# Altium project 国赛驱动板.PrjPcb
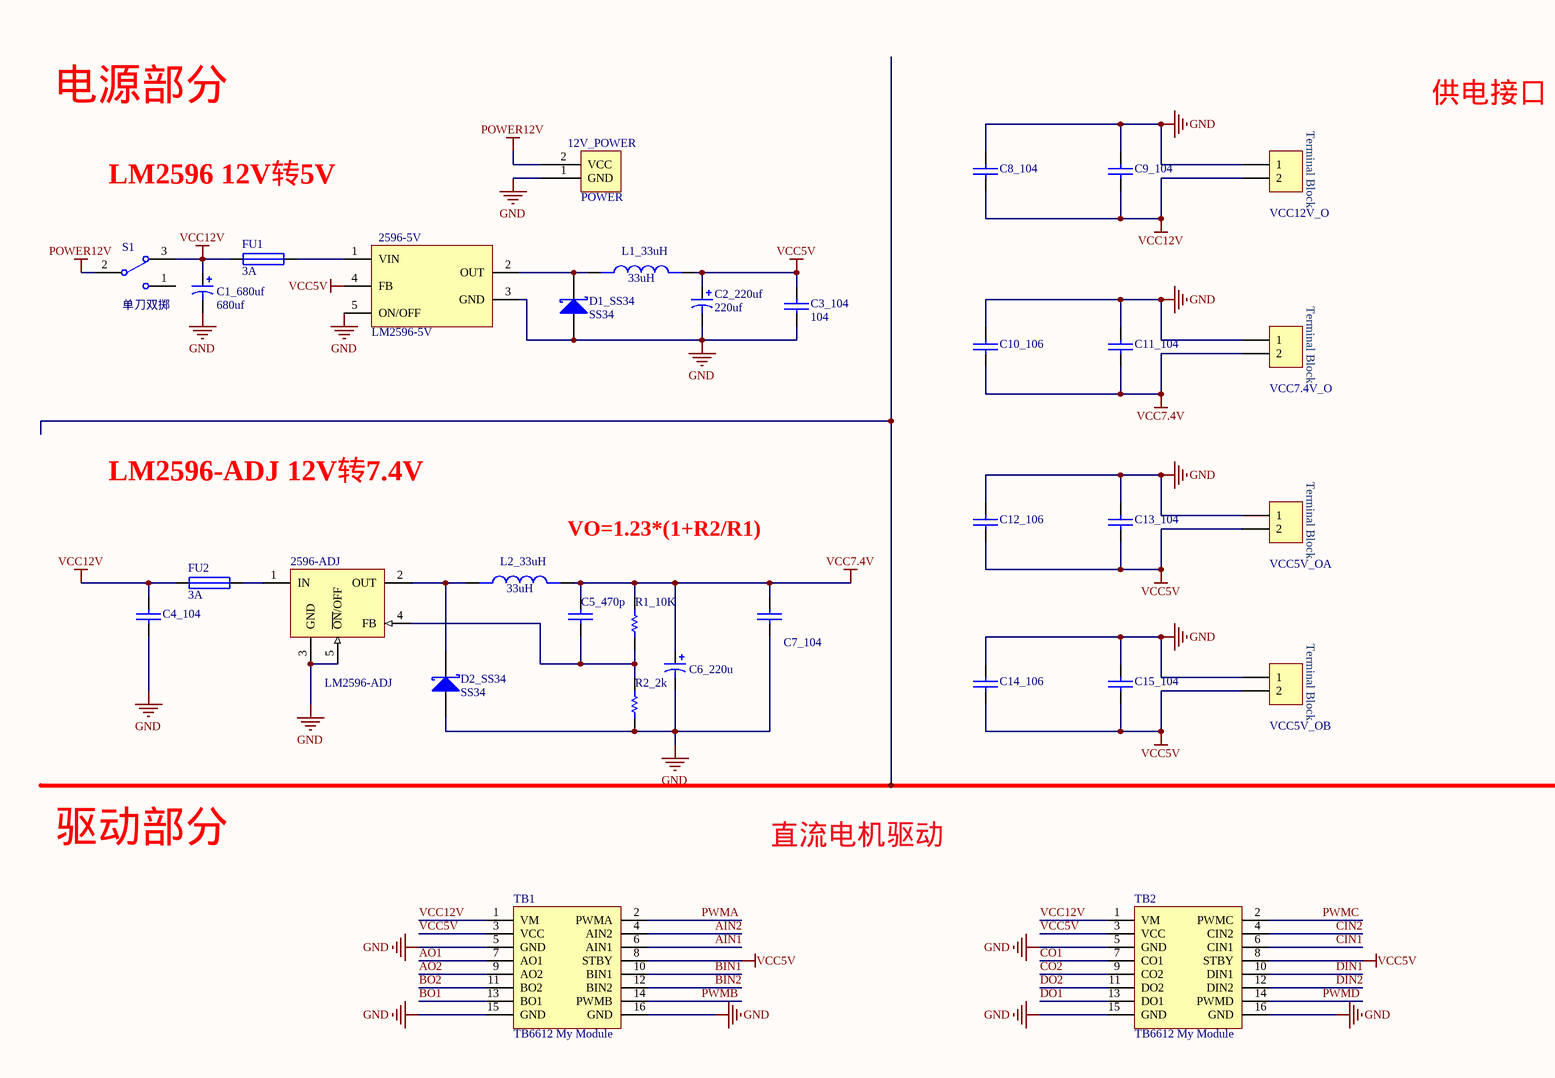
[diagram p0: 国赛驱动板原理图.SchDoc, top left]
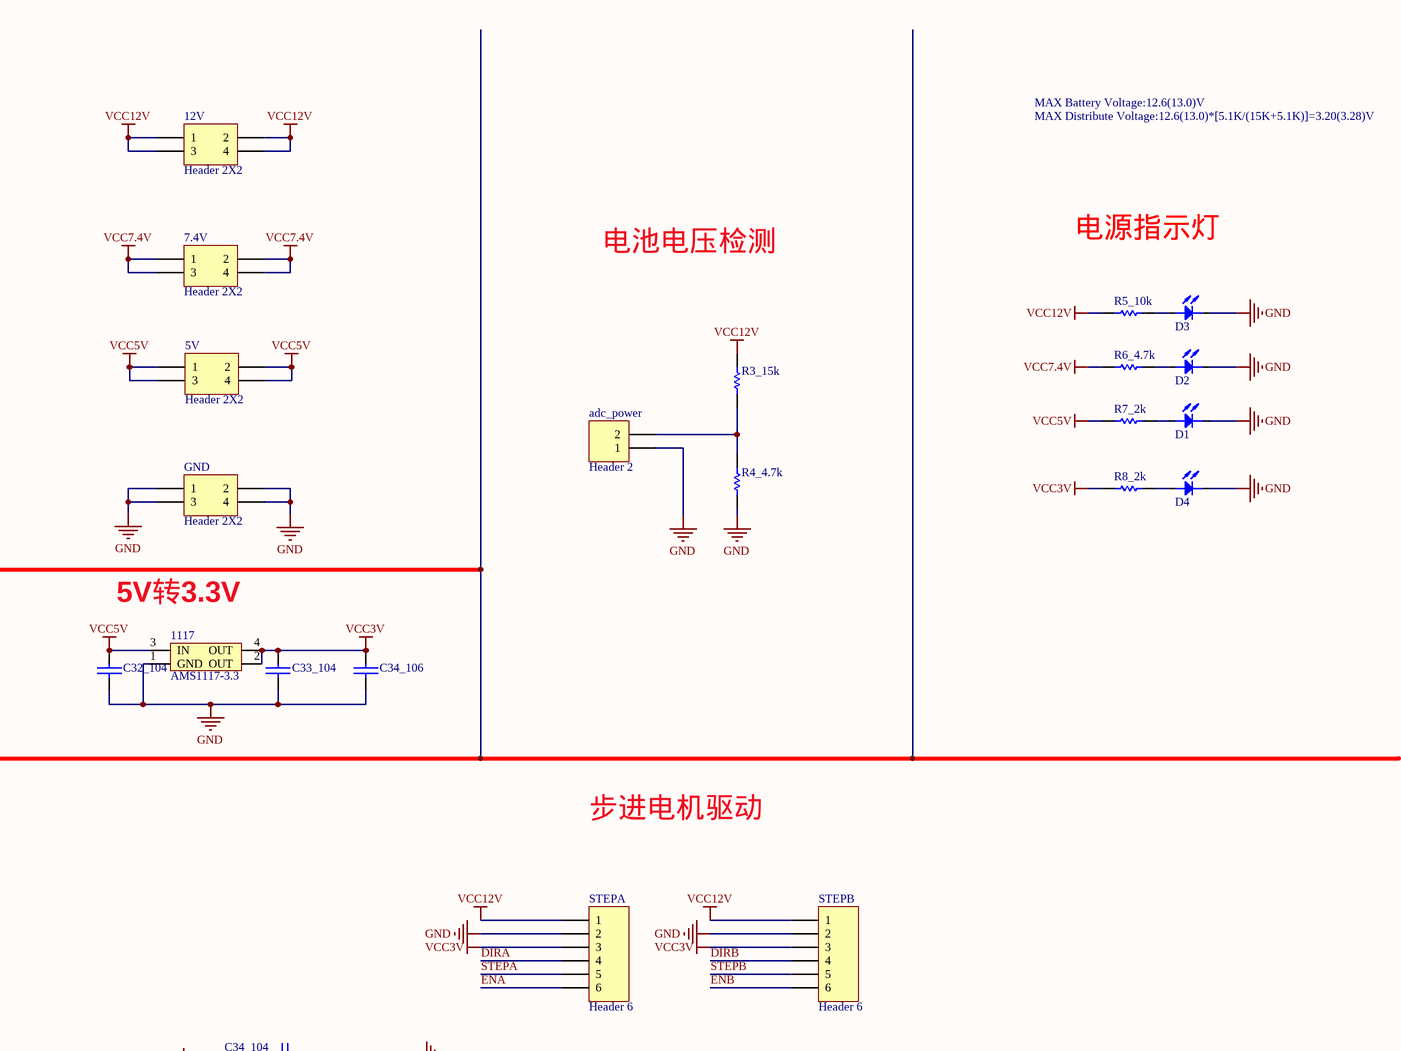
[diagram p1: 国赛驱动板原理图.SchDoc, top right]
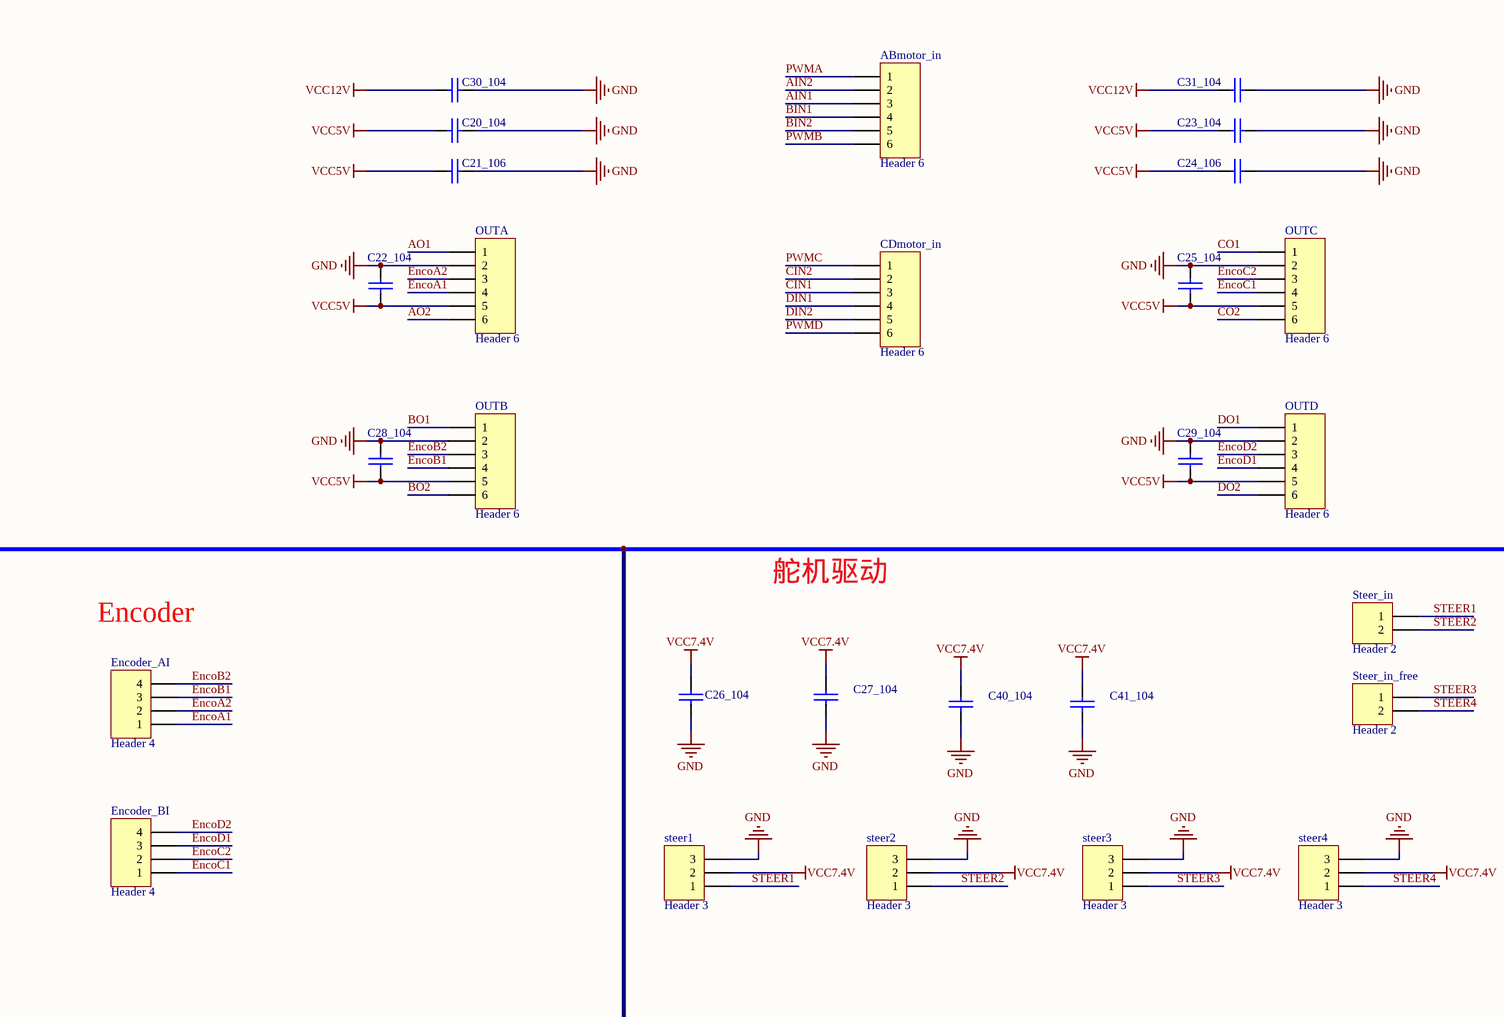
[diagram p2: 国赛驱动板原理图.SchDoc, bottom left]
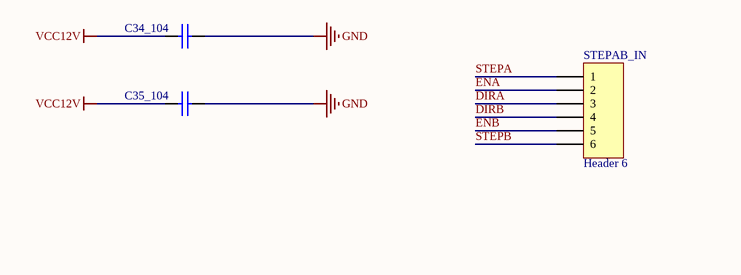
[diagram p3: 国赛驱动板原理图.SchDoc, bottom right]
1 sheet, 85 parts. Net scope: global (net labels, ports and power ports of the same name join across sheets).

## Sheet 国赛驱动板原理图.SchDoc
size A2

### Parts
5V  Header 2X2  [HDR2X2]
7.4V  Header 2X2  [HDR2X2]
12V  Header 2X2  [HDR2X2]
12V_POWER  POWER  [DG1282-5.0]
1117  AMS1117-3.3  [SOT223]
2596-5V  LM2596-5V  [TO-263-5L]
2596-ADJ  LM2596-ADJ  [TO-263-5L]
?  Header 6  [XH2.54-WS-6P]
adc_power  Header 2  [XH_2_V]
C1_680uf  value 680uf  [CAP-8*16]  (hidden comment: CAP_HER)
C2_220uf  value 220uf  [CAP-8*16]  (hidden comment: CAP_HER)
C3_104  value 104  [0805_C]  (hidden comment: CAP)
C4_104  CAP  [0805_C]  (value not drawn)
C5_470p  CAP  [0805_C]  (value not drawn)
C6_220u  CAP_HER  [CAP-8*16]  (value not drawn)
C7_104  CAP  [0805_C]  (value not drawn)
C8_104  CAP  [0805_C]  (value not drawn)
C9_104  CAP  [0805_C]  (value not drawn)
C10_106  CAP  [0805_C]  (value not drawn)
C11_104  CAP  [0805_C]  (value not drawn)
C12_106  CAP  [0805_C]  (value not drawn)
C13_104  CAP  [0805_C]  (value not drawn)
C14_106  CAP  [0805_C]  (value not drawn)
C15_104  CAP  [0805_C]  (value not drawn)
C20_104  CAP  [0805_C]  (value not drawn)
C21_106  CAP  [0805_C]  (value not drawn)
C22_104  CAP  [0805_C]  (value not drawn)
C23_104  CAP  [0805_C]  (value not drawn)
C24_106  CAP  [0805_C]  (value not drawn)
C25_104  CAP  [0805_C]  (value not drawn)
C26_104  CAP  [0805_C]  (value not drawn)
C27_104  CAP  [0805_C]  (value not drawn)
C28_104  CAP  [0805_C]  (value not drawn)
C29_104  CAP  [0805_C]  (value not drawn)
C30_104  CAP  [0805_C]  (value not drawn)
C31_104  CAP  [0805_C]  (value not drawn)
C32_104  CAP  [0805_C]  (value not drawn)
C33_104  CAP  [0805_C]  (value not drawn)
C34_104  CAP  [0805_C]  (value not drawn)
C34_106  CAP  [0805_C]  (value not drawn)
C35_104  CAP  [0805_C]  (value not drawn)
C40_104  CAP  [0805_C]  (value not drawn)
C41_104  CAP  [0805_C]  (value not drawn)
CDmotor_in  Header 6  [XH2.54-WS-6P]
D1  LED  [0805-LED]  (value not drawn)
D1_SS34  SS34  [D1810]
D2  LED  [0805-LED]  (value not drawn)
D2_SS34  SS34  [D1810]
D3  LED  [0805-LED]  (value not drawn)
D4  LED  [0805-LED]  (value not drawn)
Encoder_AI  Header 4  [XH2.54-WS-4P]
Encoder_BI  Header 4  [XH2.54-WS-4P]
FU1  3A  [1206_F]
FU2  3A  [1206_F]
GND  Header 2X2  [HDR2X2]
L1_33uH  33uH  [L_SOP127]
L2_33uH  33uH  [L_SOP127]
OUTA  Header 6  [XH2.54-WS-6P]
OUTB  Header 6  [XH2.54-WS-6P]
OUTC  Header 6  [XH2.54-WS-6P]
OUTD  Header 6  [XH2.54-WS-6P]
R1_10K  RES  [0805_R]  (value not drawn)
R2_2k  RES  [0805_R]  (value not drawn)
R3_15k  RES  [0805_R]  (value not drawn)
R4_4.7k  RES  [0805_R]  (value not drawn)
R5_10k  RES  [0805_R]  (value not drawn)
R6_4.7k  RES  [0805_R]  (value not drawn)
R7_2k  RES  [0805_R]  (value not drawn)
R8_2k  RES  [0805_R]  (value not drawn)
S1  单刀双掷  [SWITCH_3F_SPDT - 4.7mm]
steer1  Header 3  [HDR1X3]
steer2  Header 3  [HDR1X3]
steer3  Header 3  [HDR1X3]
steer4  Header 3  [HDR1X3]
Steer_in  Header 2  [XH2.54-WS-2P]
Steer_in_free  Header 2  [XH2.54-WS-2P]
STEPA  Header 6  [XH2.54-WS-6P]
STEPAB_IN  Header 6  [XH2.54-WS-6P]
STEPB  Header 6  [XH2.54-WS-6P]
TB1  TB6612 My Module  [TB6612]
TB2  TB6612 My Module  [TB6612]
VCC5V_OA  Terminal Block 2P  [DG1282-5.0]  (value not drawn)
VCC5V_OB  Terminal Block 2P  [DG1282-5.0]  (value not drawn)
VCC7.4V_O  Terminal Block 2P  [DG1282-5.0]  (value not drawn)
VCC12V_O  Terminal Block 2P  [DG1282-5.0]  (value not drawn)

### Nets
GND: 12V_POWER.1(GND) 1117.1(GND) 2596-5V.3(GND) 2596-5V.5(ON/OFF) 2596-ADJ.3(GND) 2596-ADJ.5(~{ON}/OFF) adc_power.2(1) C1_680uf.2 C2_220uf.2 C3_104.2 C4_104.2 C6_220u.2 C7_104.2 C8_104.1 C9_104.1 C10_106.1 C11_104.1 C12_106.1 C13_104.1 C14_106.1 C15_104.1 C20_104.2 C21_106.2 C22_104.1 C23_104.2 C24_106.2 C25_104.1 C26_104.2 C27_104.2 C28_104.1 C29_104.1 C30_104.2 C31_104.2 C32_104.2 C33_104.2 C34_104.2 C34_106.2 C35_104.2 C40_104.2 C41_104.2 D1.2 D1_SS34.A D2.2 D2_SS34.A D3.2 D4.2 GND.1 GND.2 GND.3 GND.4 OUTA.2 OUTB.2 OUTC.2 OUTD.2 R2_2k.1(BOT) R4_4.7k.1(BOT) steer1.3 steer2.3 steer3.3 steer4.3 STEPA.2 STEPB.2 TB1.5(GND) TB1.15(GND) TB1.16(GND) TB2.5(GND) TB2.15(GND) TB2.16(GND) VCC5V_OA.1 VCC5V_OB.1 VCC7.4V_O.1 VCC12V_O.1
POWER12V: 12V_POWER.2(VCC) S1.2
VCC3V: 1117.2(OUT) 1117.4(OUT) C33_104.1 C34_106.1 R8_2k.1(BOT) STEPA.3 STEPB.3
VCC5V: 5V.1 5V.2 5V.3 5V.4 1117.3(IN) 2596-5V.4(FB) C2_220uf.1 C3_104.1 C12_106.2 C13_104.2 C14_106.2 C15_104.2 C20_104.1 C21_106.1 C22_104.2 C23_104.1 C24_106.1 C25_104.2 C28_104.2 C29_104.2 C32_104.1 L1_33uH.2(Pri-) OUTA.5 OUTB.5 OUTC.5 OUTD.5 R7_2k.1(BOT) TB1.3(VCC) TB1.8(STBY) TB2.3(VCC) TB2.8(STBY) VCC5V_OA.2 VCC5V_OB.2
VCC7.4V: 7.4V.1 7.4V.2 7.4V.3 7.4V.4 C5_470p.1 C6_220u.1 C7_104.1 C10_106.2 C11_104.2 C26_104.1 C27_104.1 C40_104.1 C41_104.1 L2_33uH.2(Pri-) R1_10K.2(TOP) R6_4.7k.1(BOT) steer1.2 steer2.2 steer3.2 steer4.2 VCC7.4V_O.2
VCC12V: 12V.1 12V.2 12V.3 12V.4 C1_680uf.1 C4_104.1 C8_104.2 C9_104.2 C30_104.1 C31_104.1 C34_104.1 C35_104.1 FU1.1 FU2.1 R3_15k.2(TOP) R5_10k.1(BOT) S1.3 STEPA.1 STEPB.1 TB1.1(VM) TB2.1(VM) VCC12V_O.2
AIN1: ?.3 TB1.6(AIN1)
AIN2: ?.2 TB1.4(AIN2)
AO1: OUTA.1 TB1.7(AO1)
AO2: OUTA.6 TB1.9(AO2)
BIN1: ?.4 TB1.10(BIN1)
BIN2: ?.5 TB1.12(BIN2)
BO1: OUTB.1 TB1.13(BO1)
BO2: OUTB.6 TB1.11(BO2)
CIN1: CDmotor_in.3 TB2.6(CIN1)
CIN2: CDmotor_in.2 TB2.4(CIN2)
CO1: OUTC.1 TB2.7(CO1)
CO2: OUTC.6 TB2.9(CO2)
DIN1: CDmotor_in.4 TB2.10(DIN1)
DIN2: CDmotor_in.5 TB2.12(DIN2)
DIRA: STEPA.4 STEPAB_IN.3
DIRB: STEPAB_IN.4 STEPB.4
DO1: OUTD.1 TB2.13(DO1)
DO2: OUTD.6 TB2.11(DO2)
ENA: STEPA.6 STEPAB_IN.2
ENB: STEPAB_IN.5 STEPB.6
EncoA1: Encoder_AI.1 OUTA.4
EncoA2: Encoder_AI.2 OUTA.3
EncoB1: Encoder_AI.3 OUTB.4
EncoB2: Encoder_AI.4 OUTB.3
EncoC1: Encoder_BI.1 OUTC.4
EncoC2: Encoder_BI.2 OUTC.3
EncoD1: Encoder_BI.3 OUTD.4
EncoD2: Encoder_BI.4 OUTD.3
PWMA: ?.1 TB1.2(PWMA)
PWMB: ?.6 TB1.14(PWMB)
PWMC: CDmotor_in.1 TB2.2(PWMC)
PWMD: CDmotor_in.6 TB2.14(PWMD)
STEER1: steer1.1 Steer_in.1
STEER2: steer2.1 Steer_in.2
STEER3: steer3.1 Steer_in_free.1
STEER4: steer4.1 Steer_in_free.2
STEPA: STEPA.5 STEPAB_IN.1
STEPB: STEPAB_IN.6 STEPB.5
Net2596-5V_1: 2596-5V.1(VIN) FU1.2
Net2596-5V_2: 2596-5V.2(OUT) D1_SS34.K L1_33uH.1(Pri-)
Net2596-ADJ_1: 2596-ADJ.1(IN) FU2.2
Net2596-ADJ_2: 2596-ADJ.2(OUT) D2_SS34.K L2_33uH.1(Pri-)
Net2596-ADJ_4: 2596-ADJ.4(FB) C5_470p.2 R1_10K.1(BOT) R2_2k.2(TOP)
Netadc_power_1: adc_power.1(2) R3_15k.1(BOT) R4_4.7k.2(TOP)
NetD1_1: D1.1 R7_2k.2(TOP)
NetD2_1: D2.1 R6_4.7k.2(TOP)
NetD3_1: D3.1 R5_10k.2(TOP)
NetD4_1: D4.1 R8_2k.2(TOP)

Not connected (* = marked no-connect by the designer): S1 1

### Notes on the sheet
- 电源部分
- 供电接口
- MAX Battery Voltage:12.6(13.0)V
- LM2596 12V转5V
- MAX Distribute Voltage:12.6(13.0)*[5.1K/(15K+5.1K)]=3.20(3.28)V
- 电源指示灯
- 电池电压检测
- LM2596-ADJ 12V转7.4V
- (near L2_33uH) VO=1.23*(1+R2/R1)
- 5V转3.3V
- 驱动部分
- 直流电机驱动
- 步进电机驱动
- ABmotor_in
- Encoder
- 舵机驱动
- (in symbol Terminal Block 2P) Terminal Block

### Library data of the parts
5V 7.4V 12V GND = Header 2X2: Header, 2-Pin, Dual row; LatestRevisionDate: 17-Jul-2002; LatestRevisionNote: Re-released for DXP Platform.; Publisher: Altium Limited
12V_POWER = T插
1117 = AMS1117
2596-5V = LM2596: LM2576
2596-ADJ = LM2596-ADJ: DC降压芯片; BOM名称: DC稳压芯片; 版权归属: 源创客; 学习资源: www.ooocke.com
? CDmotor_in OUTA OUTB OUTC OUTD STEPA STEPAB_IN STEPB = Header 6: Header, 6-Pin; LatestRevisionDate: 17-Jul-2002; LatestRevisionNote: Re-released for DXP Platform.; Publisher: Altium Limited
adc_power Steer_in Steer_in_free = Header 2: Header, 2-Pin; LatestRevisionDate: 17-Jul-2002; LatestRevisionNote: Re-released for DXP Platform.; Publisher: Altium Limited
D1_SS34 D2_SS34 = D Schottky: Schottky Diode; Published: 8-Jun-2000; LatestRevisionDate: 17-Jul-2002; LatestRevisionNote: Re-released for DXP Platform.; PackageReference: SMB; Publisher: Altium Limited; PackageDescription: DO-214-AA/SMB; 2 C-Bend Leads; Body 5.3 x 3.6 mm, inc. leads (LxW); Code_JEDEC: DO-214-AA
Encoder_AI Encoder_BI = Header 4: Header, 4-Pin; LatestRevisionDate: 17-Jul-2002; LatestRevisionNote: Re-released for DXP Platform.; Publisher: Altium Limited
FU1 FU2 = FUSE
L1_33uH L2_33uH = IND
S1 = SW-SPDT: 开关; Published: 24-Mar-1999; LatestRevisionDate: 17-Dec-2003; LatestRevisionNote: Schematic revised, PCB Footprint replaced.; DatasheetDocument: 05-Dec-2000; PackageReference: TL36WW15050; Publisher: Altium Limited; ComponentLink1Description: Manufacturer Link; ComponentLink1URL: http://www.apem.com
steer1-steer4 = Header 3: Header, 3-Pin; LatestRevisionDate: 17-Jul-2002; LatestRevisionNote: Re-released for DXP Platform.; Publisher: Altium Limited